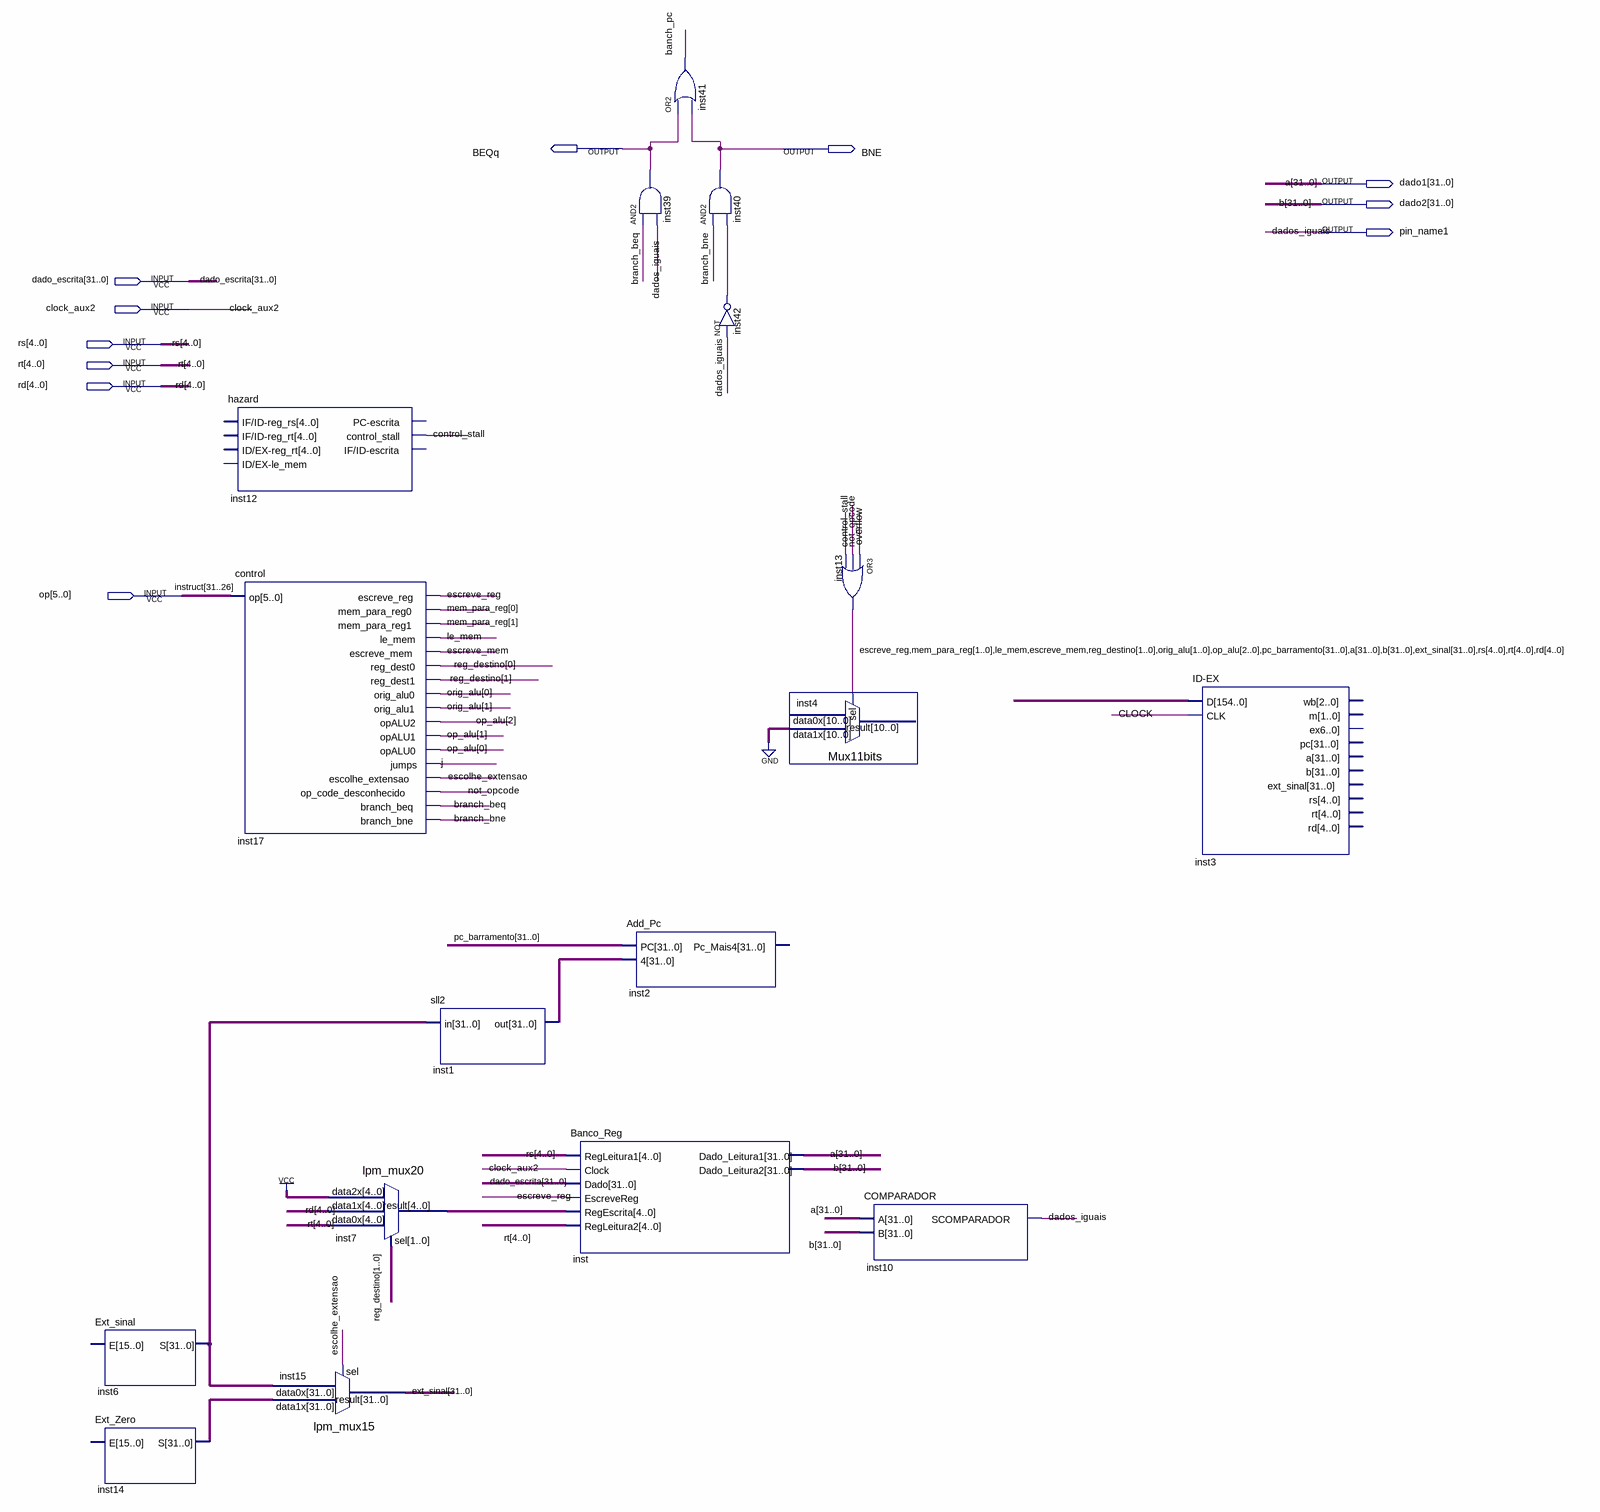
[diagram p0: schematic sheet]
// Quartus schematic Projeto_Final_2.bdf as structural Verilog: 17 symbols, 11 pins
module Projeto_Final_2 (
  input  [31:0] dado_escrita,
  input  clock_aux2,
  input  [4:0] rs,
  input  [4:0] rt,
  input  [4:0] rd,
  input  [5:0] op,
  output BEQq,
  output BNE,
  output [31:0] dado1,
  output [31:0] dado2,
  output pin_name1
);

  wire banch_pc, branch_beq, branch_bne, CLOCK, control_stall, escolhe_extensao, escreve_mem, escreve_reg,
       inst13_out, inst42_out, j, le_mem, not_opcode, overflow;
  wire [1:0] mem_para_reg, orig_alu, reg_destino;
  wire [2:0] op_alu;
  wire [4:0] inst7_result;
  wire [31:0] ext_sinal, inst1_out, inst6_s, inst14_s, pc_barramento;

  Ext_sinal inst6 (.S(inst6_s));  // open: E
  Ext_Zero inst14 (.S(inst14_s));  // open: E
  hazard inst12 (.control_stall(control_stall));  // open: IF/ID-reg_rs, IF/ID-reg_rt, ID/EX-reg_rt, ID/EX-le_mem, PC-escrita, IF/ID-escrita
  control inst17 (
    .op(op), .escreve_reg(escreve_reg), .mem_para_reg0(mem_para_reg[0]), .mem_para_reg1(mem_para_reg[1]),
    .le_mem(le_mem), .escreve_mem(escreve_mem), .reg_dest0(reg_destino[0]), .reg_dest1(reg_destino[1]),
    .orig_alu0(orig_alu[0]), .orig_alu1(orig_alu[1]), .opALU2(op_alu[2]), .opALU1(op_alu[1]),
    .opALU0(op_alu[0]), .jumps(j), .escolhe_extensao(escolhe_extensao), .op_code_desconhecido(not_opcode),
    .branch_beq(branch_beq), .branch_bne(branch_bne));
  lpm_mux15 inst15 (.data1x(inst14_s), .data0x(inst6_s), .sel(escolhe_extensao), .result(ext_sinal));
  lpm_mux20 inst7 (.data2x({5{1'b1}}), .data1x(rd), .data0x(rt), .sel(reg_destino), .result(inst7_result));
  sll2 inst1 (.in(inst6_s), .out(inst1_out));
  Banco_Reg inst (
    .RegLeitura1(rs), .Clock(clock_aux2), .Dado(dado_escrita), .EscreveReg(escreve_reg),
    .RegEscrita(inst7_result), .RegLeitura2(rt), .Dado_Leitura1(dado1), .Dado_Leitura2(dado2));
  and inst39 (BEQq, branch_beq, pin_name1);
  Add_Pc inst2 (.PC(pc_barramento), .\4 (inst1_out));  // open: Pc_Mais4
  or inst41 (banch_pc, BEQq, BNE);
  and inst40 (BNE, branch_bne, inst42_out);
  not inst42 (inst42_out, pin_name1);
  Mux11bits inst4 (.data1x({11{1'b0}}), .sel(inst13_out));  // open: data0x, result
  or inst13 (inst13_out, overflow, not_opcode, control_stall);
  COMPARADOR inst10 (.A(dado1), .B(dado2), .SCOMPARADOR(pin_name1));
  \ID-EX  inst3 (
    .D({escreve_reg, mem_para_reg, le_mem, escreve_mem, reg_destino, orig_alu, op_alu, pc_barramento, dado1, dado2, ext_sinal, rs, rt, rd}),
    .CLK(CLOCK));  // open: wb, m, ex6..0], pc, a, b, ext_sinal, rs, rt, rd

  // Other names for the same wires on the sheet: a[31:0] = dado1; b[31:0] = dado2; dados_iguais = pin_name1;
  //   instruct[31:26] = op
endmodule
